# Altium schematic sheet 8SoundsUSB-Cable.SchDoc: 8SoundsUSB- Cable
size A3; Date: 2011-12-08; CheckedBy: Checked by : S.Choquette; Author: M.Bandou; Revision: 2.0; SheetNumber: 1; SheetTotal: 1
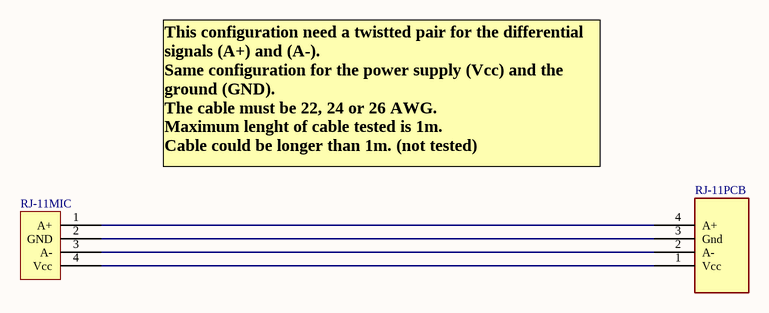
[diagram p0: 8SoundsUSB-Cable.SchDoc]

## Parts
RJ-11MIC  RJ-11-MIC  [RJ11 Micro]  (value not drawn)
RJ-11PCB  RJ-11  [PCBComponent_1]  (value not drawn)

## Nets
NetRJ-11MIC_1: RJ-11MIC.1(A+) RJ-11PCB.4(A+)
NetRJ-11MIC_2: RJ-11MIC.2(GND) RJ-11PCB.3(Gnd)
NetRJ-11MIC_3: RJ-11MIC.3(A-) RJ-11PCB.2(A-)
NetRJ-11MIC_4: RJ-11MIC.4(Vcc) RJ-11PCB.1(Vcc)

## Notes on the sheet
- This configuration need a twistted pair for the differential signals (A+) and (A-).
  Same configuration for the power supply (Vcc) and the ground (GND).
  The cable must be 22, 24 or 26 AWG.
  Maximum lenght of cable tested is 1m.
  Cable could be longer than 1m. (not tested)
- Title:
- Date:
- Sheet:
- of
- Author:
- Team members:
- M.Bandou, A.Béland, G.Cayer,
- Rev.:
- Released under Creative Common Licence Attribution-ShareAlike 2.5 Canada (CC BY-SA 2.5)
- S.Choquette, F.Gosselin,
- F.Robitaillle, D.Telly.Kizito
- Info.: http://sourceforge.net/projects/eightsoundsusb/

## Library data of the parts
RJ-11MIC = RJ-11-MIC: Part Number: 940-SP-3046; Manufacturer: Stewart Connector
RJ-11PCB = RJ-11: Part Number: 940-SP-3046; Manufacturer: Stewart Connector